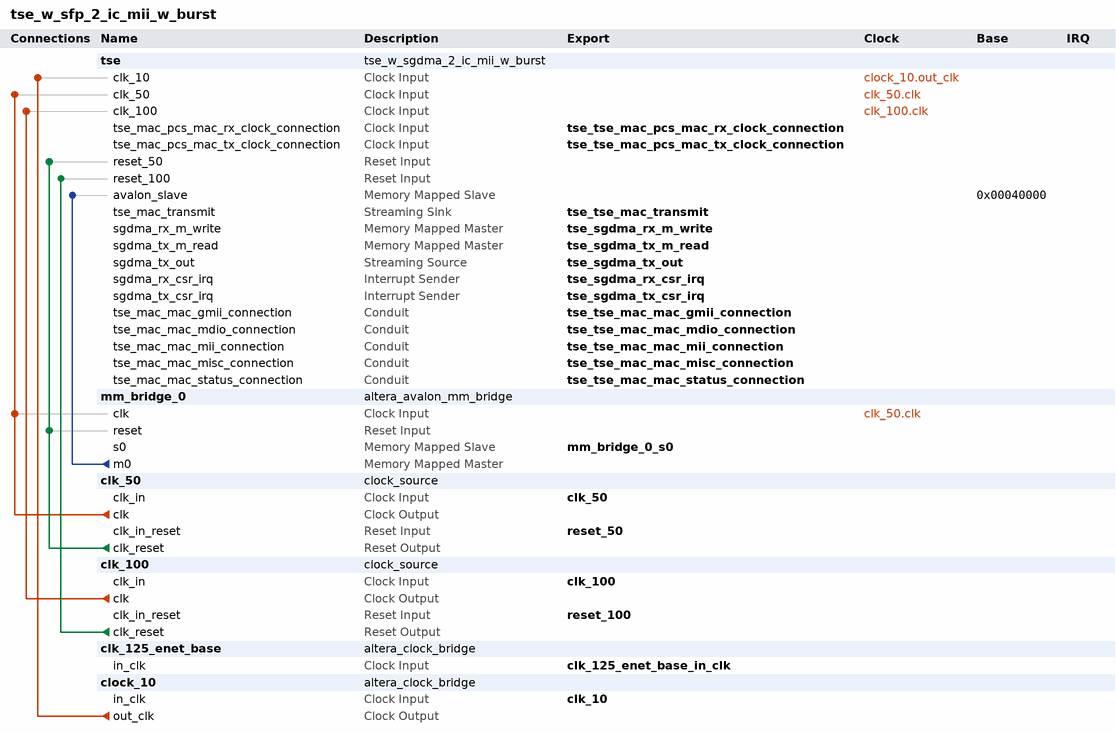
[diagram p0: system contents]
# Platform Designer (Qsys) system tse_w_sfp_2_ic_mii_w_burst, Arria V 5AGXFB3H4F35C4
# Parameters at their usual value, and those the tool derives, are not listed.
package require -exact qsys 14.1
create_system tse_w_sfp_2_ic_mii_w_burst
set_project_property DEVICE_FAMILY {Arria V}
set_project_property DEVICE 5AGXFB3H4F35C4

add_instance tse tse_w_sgdma_2_ic_mii_w_burst 1.0
set_instance_parameter_value tse LEGACY_ITEMS_SUSBSYTEM_ENABLED 0
set_instance_parameter_value tse VME_FIFO_SUBSYSTEM_ENABLED 0

add_instance mm_bridge_0 altera_avalon_mm_bridge 14.1
set_instance_parameter_value mm_bridge_0 ADDRESS_UNITS SYMBOLS
set_instance_parameter_value mm_bridge_0 ADDRESS_WIDTH 19
set_instance_parameter_value mm_bridge_0 DATA_WIDTH 32
set_instance_parameter_value mm_bridge_0 MAX_PENDING_RESPONSES 1
set_instance_parameter_value mm_bridge_0 PIPELINE_COMMAND 0
set_instance_parameter_value mm_bridge_0 PIPELINE_RESPONSE 0
set_instance_parameter_value mm_bridge_0 USE_AUTO_ADDRESS_WIDTH 0

add_instance clk_50 clock_source 14.1
set_instance_parameter_value clk_50 clockFrequency 50000000
set_instance_parameter_value clk_50 resetSynchronousEdges BOTH

add_instance clk_100 clock_source 14.1
set_instance_parameter_value clk_100 clockFrequency 100000000
set_instance_parameter_value clk_100 resetSynchronousEdges BOTH

add_instance clk_125_enet_base altera_clock_bridge 14.1
set_instance_parameter_value clk_125_enet_base DERIVED_CLOCK_RATE 0
set_instance_parameter_value clk_125_enet_base EXPLICIT_CLOCK_RATE 125000000

add_instance clock_10 altera_clock_bridge 14.1
set_instance_parameter_value clock_10 DERIVED_CLOCK_RATE 0
set_instance_parameter_value clock_10 EXPLICIT_CLOCK_RATE 10000000

# connections
add_connection clk_50.clk mm_bridge_0.clk clock
add_connection clk_50.clk tse.clk_50 clock
add_connection clk_100.clk tse.clk_100 clock
add_connection clock_10.out_clk tse.clk_10 clock
add_connection clk_50.clk_reset mm_bridge_0.reset reset
add_connection clk_50.clk_reset tse.reset_50 reset
add_connection clk_100.clk_reset tse.reset_100 reset
add_connection mm_bridge_0.m0 tse.avalon_slave avalon
set_connection_parameter_value mm_bridge_0.m0/tse.avalon_slave baseAddress 0x00040000

# exported interfaces
add_interface clk_10 clock sink
set_interface_property clk_10 EXPORT_OF clock_10.in_clk
add_interface clk_100 clock sink
set_interface_property clk_100 EXPORT_OF clk_100.clk_in
add_interface clk_125_enet_base_in_clk clock sink
set_interface_property clk_125_enet_base_in_clk EXPORT_OF clk_125_enet_base.in_clk
add_interface clk_50 clock sink
set_interface_property clk_50 EXPORT_OF clk_50.clk_in
add_interface mm_bridge_0_s0 avalon slave
set_interface_property mm_bridge_0_s0 EXPORT_OF mm_bridge_0.s0
add_interface reset_100 reset sink
set_interface_property reset_100 EXPORT_OF clk_100.clk_in_reset
add_interface reset_50 reset sink
set_interface_property reset_50 EXPORT_OF clk_50.clk_in_reset
add_interface tse_sgdma_rx_csr_irq interrupt sender
set_interface_property tse_sgdma_rx_csr_irq EXPORT_OF tse.sgdma_rx_csr_irq
add_interface tse_sgdma_rx_m_write avalon master
set_interface_property tse_sgdma_rx_m_write EXPORT_OF tse.sgdma_rx_m_write
add_interface tse_sgdma_tx_csr_irq interrupt sender
set_interface_property tse_sgdma_tx_csr_irq EXPORT_OF tse.sgdma_tx_csr_irq
add_interface tse_sgdma_tx_m_read avalon master
set_interface_property tse_sgdma_tx_m_read EXPORT_OF tse.sgdma_tx_m_read
add_interface tse_sgdma_tx_out avalon_streaming source
set_interface_property tse_sgdma_tx_out EXPORT_OF tse.sgdma_tx_out
add_interface tse_tse_mac_mac_gmii_connection conduit end
set_interface_property tse_tse_mac_mac_gmii_connection EXPORT_OF tse.tse_mac_mac_gmii_connection
add_interface tse_tse_mac_mac_mdio_connection conduit end
set_interface_property tse_tse_mac_mac_mdio_connection EXPORT_OF tse.tse_mac_mac_mdio_connection
add_interface tse_tse_mac_mac_mii_connection conduit end
set_interface_property tse_tse_mac_mac_mii_connection EXPORT_OF tse.tse_mac_mac_mii_connection
add_interface tse_tse_mac_mac_misc_connection conduit end
set_interface_property tse_tse_mac_mac_misc_connection EXPORT_OF tse.tse_mac_mac_misc_connection
add_interface tse_tse_mac_mac_status_connection conduit end
set_interface_property tse_tse_mac_mac_status_connection EXPORT_OF tse.tse_mac_mac_status_connection
add_interface tse_tse_mac_pcs_mac_rx_clock_connection clock sink
set_interface_property tse_tse_mac_pcs_mac_rx_clock_connection EXPORT_OF tse.tse_mac_pcs_mac_rx_clock_connection
add_interface tse_tse_mac_pcs_mac_tx_clock_connection clock sink
set_interface_property tse_tse_mac_pcs_mac_tx_clock_connection EXPORT_OF tse.tse_mac_pcs_mac_tx_clock_connection
add_interface tse_tse_mac_transmit avalon_streaming sink
set_interface_property tse_tse_mac_transmit EXPORT_OF tse.tse_mac_transmit

set_interconnect_requirement {$system} qsys_mm.clockCrossingAdapter HANDSHAKE
set_interconnect_requirement {$system} qsys_mm.insertDefaultSlave FALSE
set_interconnect_requirement {$system} qsys_mm.maxAdditionalLatency 2

save_system tse_w_sfp_2_ic_mii_w_burst.qsys
